# EasyEDA schematic Layout.json
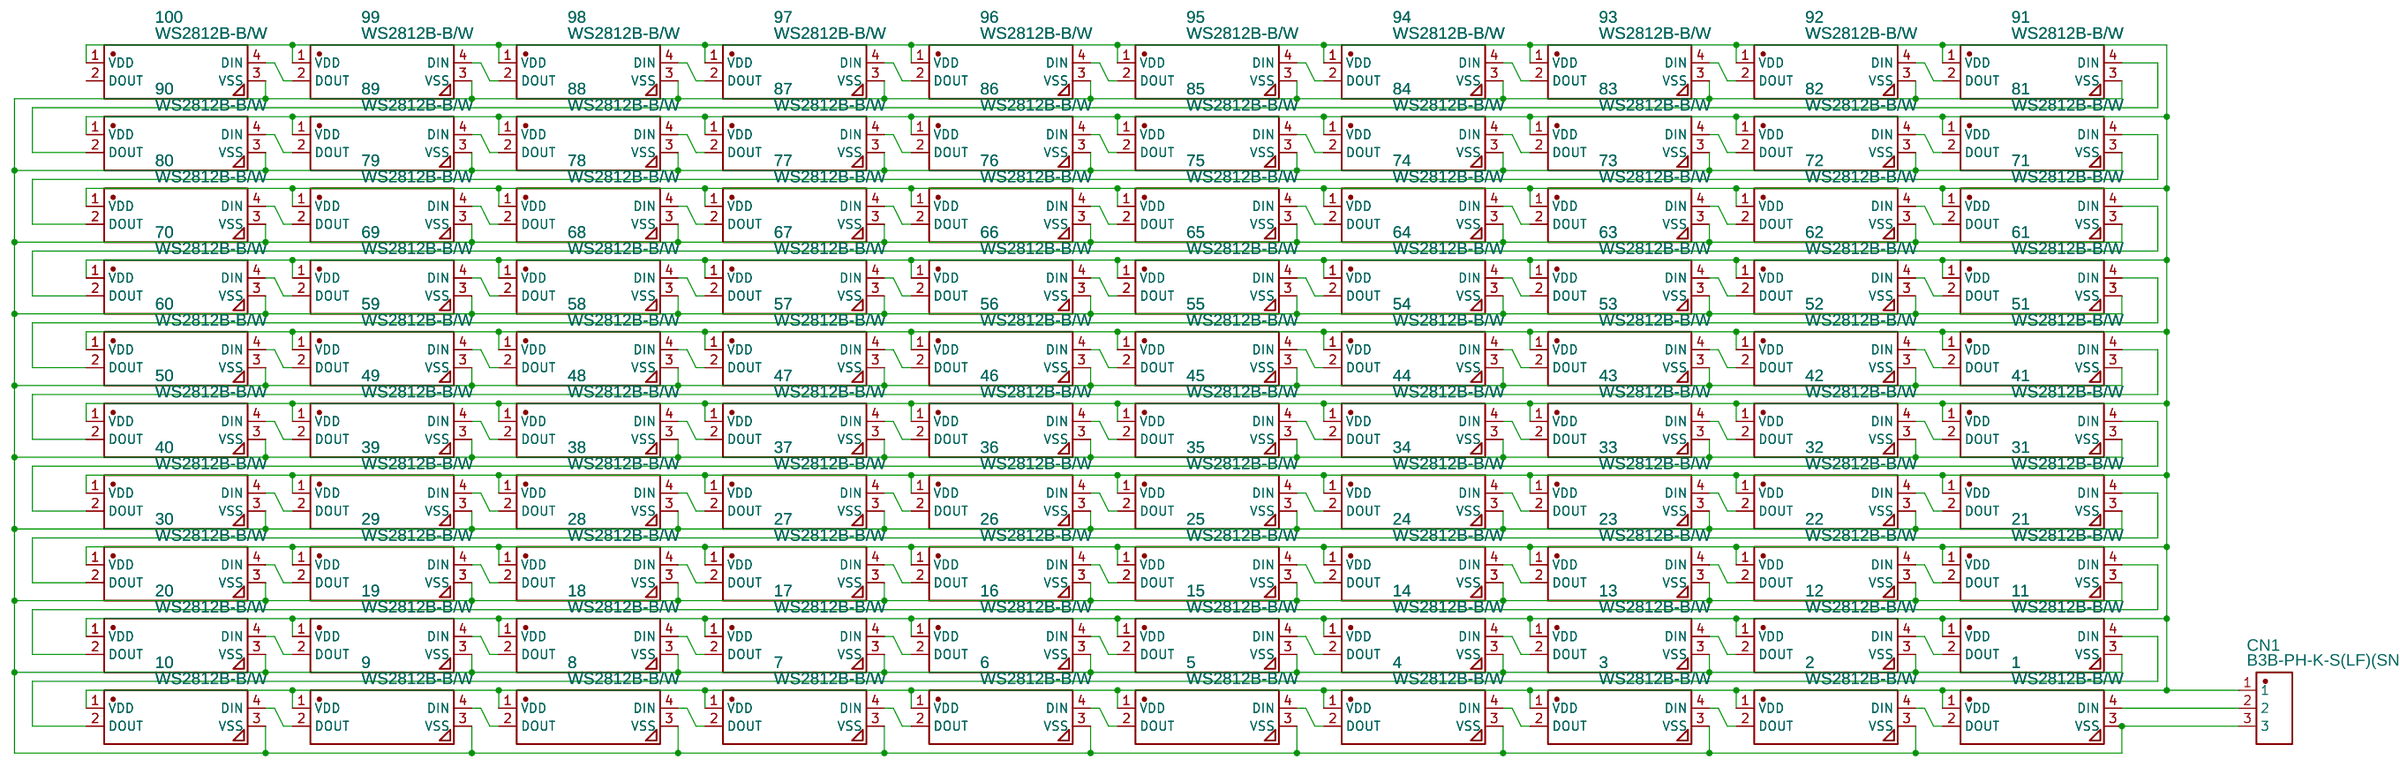
[diagram p0: schematic sheet]

## Parts
1  WS2812B-B/W  [LED-SMD_4P-L5.0-W5.0-TL_WS2812B-B]
2  WS2812B-B/W  [LED-SMD_4P-L5.0-W5.0-TL_WS2812B-B]
3  WS2812B-B/W  [LED-SMD_4P-L5.0-W5.0-TL_WS2812B-B]
4  WS2812B-B/W  [LED-SMD_4P-L5.0-W5.0-TL_WS2812B-B]
5  WS2812B-B/W  [LED-SMD_4P-L5.0-W5.0-TL_WS2812B-B]
6  WS2812B-B/W  [LED-SMD_4P-L5.0-W5.0-TL_WS2812B-B]
7  WS2812B-B/W  [LED-SMD_4P-L5.0-W5.0-TL_WS2812B-B]
8  WS2812B-B/W  [LED-SMD_4P-L5.0-W5.0-TL_WS2812B-B]
9  WS2812B-B/W  [LED-SMD_4P-L5.0-W5.0-TL_WS2812B-B]
10  WS2812B-B/W  [LED-SMD_4P-L5.0-W5.0-TL_WS2812B-B]
11  WS2812B-B/W  [LED-SMD_4P-L5.0-W5.0-TL_WS2812B-B]
12  WS2812B-B/W  [LED-SMD_4P-L5.0-W5.0-TL_WS2812B-B]
13  WS2812B-B/W  [LED-SMD_4P-L5.0-W5.0-TL_WS2812B-B]
14  WS2812B-B/W  [LED-SMD_4P-L5.0-W5.0-TL_WS2812B-B]
15  WS2812B-B/W  [LED-SMD_4P-L5.0-W5.0-TL_WS2812B-B]
16  WS2812B-B/W  [LED-SMD_4P-L5.0-W5.0-TL_WS2812B-B]
17  WS2812B-B/W  [LED-SMD_4P-L5.0-W5.0-TL_WS2812B-B]
18  WS2812B-B/W  [LED-SMD_4P-L5.0-W5.0-TL_WS2812B-B]
19  WS2812B-B/W  [LED-SMD_4P-L5.0-W5.0-TL_WS2812B-B]
20  WS2812B-B/W  [LED-SMD_4P-L5.0-W5.0-TL_WS2812B-B]
21  WS2812B-B/W  [LED-SMD_4P-L5.0-W5.0-TL_WS2812B-B]
22  WS2812B-B/W  [LED-SMD_4P-L5.0-W5.0-TL_WS2812B-B]
23  WS2812B-B/W  [LED-SMD_4P-L5.0-W5.0-TL_WS2812B-B]
24  WS2812B-B/W  [LED-SMD_4P-L5.0-W5.0-TL_WS2812B-B]
25  WS2812B-B/W  [LED-SMD_4P-L5.0-W5.0-TL_WS2812B-B]
26  WS2812B-B/W  [LED-SMD_4P-L5.0-W5.0-TL_WS2812B-B]
27  WS2812B-B/W  [LED-SMD_4P-L5.0-W5.0-TL_WS2812B-B]
28  WS2812B-B/W  [LED-SMD_4P-L5.0-W5.0-TL_WS2812B-B]
29  WS2812B-B/W  [LED-SMD_4P-L5.0-W5.0-TL_WS2812B-B]
30  WS2812B-B/W  [LED-SMD_4P-L5.0-W5.0-TL_WS2812B-B]
31  WS2812B-B/W  [LED-SMD_4P-L5.0-W5.0-TL_WS2812B-B]
32  WS2812B-B/W  [LED-SMD_4P-L5.0-W5.0-TL_WS2812B-B]
33  WS2812B-B/W  [LED-SMD_4P-L5.0-W5.0-TL_WS2812B-B]
34  WS2812B-B/W  [LED-SMD_4P-L5.0-W5.0-TL_WS2812B-B]
35  WS2812B-B/W  [LED-SMD_4P-L5.0-W5.0-TL_WS2812B-B]
36  WS2812B-B/W  [LED-SMD_4P-L5.0-W5.0-TL_WS2812B-B]
37  WS2812B-B/W  [LED-SMD_4P-L5.0-W5.0-TL_WS2812B-B]
38  WS2812B-B/W  [LED-SMD_4P-L5.0-W5.0-TL_WS2812B-B]
39  WS2812B-B/W  [LED-SMD_4P-L5.0-W5.0-TL_WS2812B-B]
40  WS2812B-B/W  [LED-SMD_4P-L5.0-W5.0-TL_WS2812B-B]
41  WS2812B-B/W  [LED-SMD_4P-L5.0-W5.0-TL_WS2812B-B]
42  WS2812B-B/W  [LED-SMD_4P-L5.0-W5.0-TL_WS2812B-B]
43  WS2812B-B/W  [LED-SMD_4P-L5.0-W5.0-TL_WS2812B-B]
44  WS2812B-B/W  [LED-SMD_4P-L5.0-W5.0-TL_WS2812B-B]
45  WS2812B-B/W  [LED-SMD_4P-L5.0-W5.0-TL_WS2812B-B]
46  WS2812B-B/W  [LED-SMD_4P-L5.0-W5.0-TL_WS2812B-B]
47  WS2812B-B/W  [LED-SMD_4P-L5.0-W5.0-TL_WS2812B-B]
48  WS2812B-B/W  [LED-SMD_4P-L5.0-W5.0-TL_WS2812B-B]
49  WS2812B-B/W  [LED-SMD_4P-L5.0-W5.0-TL_WS2812B-B]
50  WS2812B-B/W  [LED-SMD_4P-L5.0-W5.0-TL_WS2812B-B]
51  WS2812B-B/W  [LED-SMD_4P-L5.0-W5.0-TL_WS2812B-B]
52  WS2812B-B/W  [LED-SMD_4P-L5.0-W5.0-TL_WS2812B-B]
53  WS2812B-B/W  [LED-SMD_4P-L5.0-W5.0-TL_WS2812B-B]
54  WS2812B-B/W  [LED-SMD_4P-L5.0-W5.0-TL_WS2812B-B]
55  WS2812B-B/W  [LED-SMD_4P-L5.0-W5.0-TL_WS2812B-B]
56  WS2812B-B/W  [LED-SMD_4P-L5.0-W5.0-TL_WS2812B-B]
57  WS2812B-B/W  [LED-SMD_4P-L5.0-W5.0-TL_WS2812B-B]
58  WS2812B-B/W  [LED-SMD_4P-L5.0-W5.0-TL_WS2812B-B]
59  WS2812B-B/W  [LED-SMD_4P-L5.0-W5.0-TL_WS2812B-B]
60  WS2812B-B/W  [LED-SMD_4P-L5.0-W5.0-TL_WS2812B-B]
61  WS2812B-B/W  [LED-SMD_4P-L5.0-W5.0-TL_WS2812B-B]
62  WS2812B-B/W  [LED-SMD_4P-L5.0-W5.0-TL_WS2812B-B]
63  WS2812B-B/W  [LED-SMD_4P-L5.0-W5.0-TL_WS2812B-B]
64  WS2812B-B/W  [LED-SMD_4P-L5.0-W5.0-TL_WS2812B-B]
65  WS2812B-B/W  [LED-SMD_4P-L5.0-W5.0-TL_WS2812B-B]
66  WS2812B-B/W  [LED-SMD_4P-L5.0-W5.0-TL_WS2812B-B]
67  WS2812B-B/W  [LED-SMD_4P-L5.0-W5.0-TL_WS2812B-B]
68  WS2812B-B/W  [LED-SMD_4P-L5.0-W5.0-TL_WS2812B-B]
69  WS2812B-B/W  [LED-SMD_4P-L5.0-W5.0-TL_WS2812B-B]
70  WS2812B-B/W  [LED-SMD_4P-L5.0-W5.0-TL_WS2812B-B]
71  WS2812B-B/W  [LED-SMD_4P-L5.0-W5.0-TL_WS2812B-B]
72  WS2812B-B/W  [LED-SMD_4P-L5.0-W5.0-TL_WS2812B-B]
73  WS2812B-B/W  [LED-SMD_4P-L5.0-W5.0-TL_WS2812B-B]
74  WS2812B-B/W  [LED-SMD_4P-L5.0-W5.0-TL_WS2812B-B]
75  WS2812B-B/W  [LED-SMD_4P-L5.0-W5.0-TL_WS2812B-B]
76  WS2812B-B/W  [LED-SMD_4P-L5.0-W5.0-TL_WS2812B-B]
77  WS2812B-B/W  [LED-SMD_4P-L5.0-W5.0-TL_WS2812B-B]
78  WS2812B-B/W  [LED-SMD_4P-L5.0-W5.0-TL_WS2812B-B]
79  WS2812B-B/W  [LED-SMD_4P-L5.0-W5.0-TL_WS2812B-B]
80  WS2812B-B/W  [LED-SMD_4P-L5.0-W5.0-TL_WS2812B-B]
81  WS2812B-B/W  [LED-SMD_4P-L5.0-W5.0-TL_WS2812B-B]
82  WS2812B-B/W  [LED-SMD_4P-L5.0-W5.0-TL_WS2812B-B]
83  WS2812B-B/W  [LED-SMD_4P-L5.0-W5.0-TL_WS2812B-B]
84  WS2812B-B/W  [LED-SMD_4P-L5.0-W5.0-TL_WS2812B-B]
85  WS2812B-B/W  [LED-SMD_4P-L5.0-W5.0-TL_WS2812B-B]
86  WS2812B-B/W  [LED-SMD_4P-L5.0-W5.0-TL_WS2812B-B]
87  WS2812B-B/W  [LED-SMD_4P-L5.0-W5.0-TL_WS2812B-B]
88  WS2812B-B/W  [LED-SMD_4P-L5.0-W5.0-TL_WS2812B-B]
89  WS2812B-B/W  [LED-SMD_4P-L5.0-W5.0-TL_WS2812B-B]
90  WS2812B-B/W  [LED-SMD_4P-L5.0-W5.0-TL_WS2812B-B]
91  WS2812B-B/W  [LED-SMD_4P-L5.0-W5.0-TL_WS2812B-B]
92  WS2812B-B/W  [LED-SMD_4P-L5.0-W5.0-TL_WS2812B-B]
93  WS2812B-B/W  [LED-SMD_4P-L5.0-W5.0-TL_WS2812B-B]
94  WS2812B-B/W  [LED-SMD_4P-L5.0-W5.0-TL_WS2812B-B]
95  WS2812B-B/W  [LED-SMD_4P-L5.0-W5.0-TL_WS2812B-B]
96  WS2812B-B/W  [LED-SMD_4P-L5.0-W5.0-TL_WS2812B-B]
97  WS2812B-B/W  [LED-SMD_4P-L5.0-W5.0-TL_WS2812B-B]
98  WS2812B-B/W  [LED-SMD_4P-L5.0-W5.0-TL_WS2812B-B]
99  WS2812B-B/W  [LED-SMD_4P-L5.0-W5.0-TL_WS2812B-B]
100  WS2812B-B/W  [LED-SMD_4P-L5.0-W5.0-TL_WS2812B-B]
CN1  B3B-PH-K-S(LF)(SN)  [CONN-TH_B3B-PH-K-S]

## Library data of the parts
1-100 = WS2812B-B/W: Contributor: LCSC; Supplier: LCSC; Supplier Part: C2761795; Manufacturer: worldsemi; Manufacturer Part: WS2812B-B/T; JLCPCB Part Class: Extended Part
CN1 = B3B-PH-K-S(LF)(SN): Contributor: LCSC; Supplier: LCSC; Manufacturer: JST; Supplier Part: C131339; JLCPCB Part Class: Extended Part

## Nets
Net-(1-1): 1.1(VDD) 2.1(VDD) 3.1(VDD) 4.1(VDD) 5.1(VDD) 6.1(VDD) 7.1(VDD) 8.1(VDD) 9.1(VDD) 10.1(VDD) 11.1(VDD) 12.1(VDD) 13.1(VDD) 14.1(VDD) 15.1(VDD) 16.1(VDD) 17.1(VDD) 18.1(VDD) 19.1(VDD) 20.1(VDD) 21.1(VDD) 22.1(VDD) 23.1(VDD) 24.1(VDD) 25.1(VDD) 26.1(VDD) 27.1(VDD) 28.1(VDD) 29.1(VDD) 30.1(VDD) 31.1(VDD) 32.1(VDD) 33.1(VDD) 34.1(VDD) 35.1(VDD) 36.1(VDD) 37.1(VDD) 38.1(VDD) 39.1(VDD) 40.1(VDD) 41.1(VDD) 42.1(VDD) 43.1(VDD) 44.1(VDD) 45.1(VDD) 46.1(VDD) 47.1(VDD) 48.1(VDD) 49.1(VDD) 50.1(VDD) 51.1(VDD) 52.1(VDD) 53.1(VDD) 54.1(VDD) 55.1(VDD) 56.1(VDD) 57.1(VDD) 58.1(VDD) 59.1(VDD) 60.1(VDD) 61.1(VDD) 62.1(VDD) 63.1(VDD) 64.1(VDD) 65.1(VDD) 66.1(VDD) 67.1(VDD) 68.1(VDD) 69.1(VDD) 70.1(VDD) 71.1(VDD) 72.1(VDD) 73.1(VDD) 74.1(VDD) 75.1(VDD) 76.1(VDD) 77.1(VDD) 78.1(VDD) 79.1(VDD) 80.1(VDD) 81.1(VDD) 82.1(VDD) 83.1(VDD) 84.1(VDD) 85.1(VDD) 86.1(VDD) 87.1(VDD) 88.1(VDD) 89.1(VDD) 90.1(VDD) 91.1(VDD) 92.1(VDD) 93.1(VDD) 94.1(VDD) 95.1(VDD) 96.1(VDD) 97.1(VDD) 98.1(VDD) 99.1(VDD) 100.1(VDD) CN1.1
Net-(1-2): 1.2(DOUT) 2.4(DIN)
Net-(1-3): 1.3(VSS) 2.3(VSS) 3.3(VSS) 4.3(VSS) 5.3(VSS) 6.3(VSS) 7.3(VSS) 8.3(VSS) 9.3(VSS) 10.3(VSS) 11.3(VSS) 12.3(VSS) 13.3(VSS) 14.3(VSS) 15.3(VSS) 16.3(VSS) 17.3(VSS) 18.3(VSS) 19.3(VSS) 20.3(VSS) 21.3(VSS) 22.3(VSS) 23.3(VSS) 24.3(VSS) 25.3(VSS) 26.3(VSS) 27.3(VSS) 28.3(VSS) 29.3(VSS) 30.3(VSS) 31.3(VSS) 32.3(VSS) 33.3(VSS) 34.3(VSS) 35.3(VSS) 36.3(VSS) 37.3(VSS) 38.3(VSS) 39.3(VSS) 40.3(VSS) 41.3(VSS) 42.3(VSS) 43.3(VSS) 44.3(VSS) 45.3(VSS) 46.3(VSS) 47.3(VSS) 48.3(VSS) 49.3(VSS) 50.3(VSS) 51.3(VSS) 52.3(VSS) 53.3(VSS) 54.3(VSS) 55.3(VSS) 56.3(VSS) 57.3(VSS) 58.3(VSS) 59.3(VSS) 60.3(VSS) 61.3(VSS) 62.3(VSS) 63.3(VSS) 64.3(VSS) 65.3(VSS) 66.3(VSS) 67.3(VSS) 68.3(VSS) 69.3(VSS) 70.3(VSS) 71.3(VSS) 72.3(VSS) 73.3(VSS) 74.3(VSS) 75.3(VSS) 76.3(VSS) 77.3(VSS) 78.3(VSS) 79.3(VSS) 80.3(VSS) 81.3(VSS) 82.3(VSS) 83.3(VSS) 84.3(VSS) 85.3(VSS) 86.3(VSS) 87.3(VSS) 88.3(VSS) 89.3(VSS) 90.3(VSS) 91.3(VSS) 92.3(VSS) 93.3(VSS) 94.3(VSS) 95.3(VSS) 96.3(VSS) 97.3(VSS) 98.3(VSS) 99.3(VSS) 100.3(VSS) CN1.3
Net-(1-4): 1.4(DIN) CN1.2
Net-(2-2): 2.2(DOUT) 3.4(DIN)
Net-(3-2): 3.2(DOUT) 4.4(DIN)
Net-(4-2): 4.2(DOUT) 5.4(DIN)
Net-(5-2): 5.2(DOUT) 6.4(DIN)
Net-(6-2): 6.2(DOUT) 7.4(DIN)
Net-(7-2): 7.2(DOUT) 8.4(DIN)
Net-(8-2): 8.2(DOUT) 9.4(DIN)
Net-(9-2): 9.2(DOUT) 10.4(DIN)
Net-(10-2): 10.2(DOUT) 11.4(DIN)
Net-(11-2): 11.2(DOUT) 12.4(DIN)
Net-(12-2): 12.2(DOUT) 13.4(DIN)
Net-(13-2): 13.2(DOUT) 14.4(DIN)
Net-(14-2): 14.2(DOUT) 15.4(DIN)
Net-(15-2): 15.2(DOUT) 16.4(DIN)
Net-(16-2): 16.2(DOUT) 17.4(DIN)
Net-(17-2): 17.2(DOUT) 18.4(DIN)
Net-(18-2): 18.2(DOUT) 19.4(DIN)
Net-(19-2): 19.2(DOUT) 20.4(DIN)
Net-(20-2): 20.2(DOUT) 21.4(DIN)
Net-(21-2): 21.2(DOUT) 22.4(DIN)
Net-(22-2): 22.2(DOUT) 23.4(DIN)
Net-(23-2): 23.2(DOUT) 24.4(DIN)
Net-(24-2): 24.2(DOUT) 25.4(DIN)
Net-(25-2): 25.2(DOUT) 26.4(DIN)
Net-(26-2): 26.2(DOUT) 27.4(DIN)
Net-(27-2): 27.2(DOUT) 28.4(DIN)
Net-(28-2): 28.2(DOUT) 29.4(DIN)
Net-(29-2): 29.2(DOUT) 30.4(DIN)
Net-(30-2): 30.2(DOUT) 31.4(DIN)
Net-(31-2): 31.2(DOUT) 32.4(DIN)
Net-(32-2): 32.2(DOUT) 33.4(DIN)
Net-(33-2): 33.2(DOUT) 34.4(DIN)
Net-(34-2): 34.2(DOUT) 35.4(DIN)
Net-(35-2): 35.2(DOUT) 36.4(DIN)
Net-(36-2): 36.2(DOUT) 37.4(DIN)
Net-(37-2): 37.2(DOUT) 38.4(DIN)
Net-(38-2): 38.2(DOUT) 39.4(DIN)
Net-(39-2): 39.2(DOUT) 40.4(DIN)
Net-(40-2): 40.2(DOUT) 41.4(DIN)
Net-(41-2): 41.2(DOUT) 42.4(DIN)
Net-(42-2): 42.2(DOUT) 43.4(DIN)
Net-(43-2): 43.2(DOUT) 44.4(DIN)
Net-(44-2): 44.2(DOUT) 45.4(DIN)
Net-(45-2): 45.2(DOUT) 46.4(DIN)
Net-(46-2): 46.2(DOUT) 47.4(DIN)
Net-(47-2): 47.2(DOUT) 48.4(DIN)
Net-(48-2): 48.2(DOUT) 49.4(DIN)
Net-(49-2): 49.2(DOUT) 50.4(DIN)
Net-(50-2): 50.2(DOUT) 51.4(DIN)
Net-(51-2): 51.2(DOUT) 52.4(DIN)
Net-(52-2): 52.2(DOUT) 53.4(DIN)
Net-(53-2): 53.2(DOUT) 54.4(DIN)
Net-(54-2): 54.2(DOUT) 55.4(DIN)
Net-(55-2): 55.2(DOUT) 56.4(DIN)
Net-(56-2): 56.2(DOUT) 57.4(DIN)
Net-(57-2): 57.2(DOUT) 58.4(DIN)
Net-(58-2): 58.2(DOUT) 59.4(DIN)
Net-(59-2): 59.2(DOUT) 60.4(DIN)
Net-(60-2): 60.2(DOUT) 61.4(DIN)
Net-(61-2): 61.2(DOUT) 62.4(DIN)
Net-(62-2): 62.2(DOUT) 63.4(DIN)
Net-(63-2): 63.2(DOUT) 64.4(DIN)
Net-(64-2): 64.2(DOUT) 65.4(DIN)
Net-(65-2): 65.2(DOUT) 66.4(DIN)
Net-(66-2): 66.2(DOUT) 67.4(DIN)
Net-(67-2): 67.2(DOUT) 68.4(DIN)
Net-(68-2): 68.2(DOUT) 69.4(DIN)
Net-(69-2): 69.2(DOUT) 70.4(DIN)
Net-(70-2): 70.2(DOUT) 71.4(DIN)
Net-(71-2): 71.2(DOUT) 72.4(DIN)
Net-(72-2): 72.2(DOUT) 73.4(DIN)
Net-(73-2): 73.2(DOUT) 74.4(DIN)
Net-(74-2): 74.2(DOUT) 75.4(DIN)
Net-(75-2): 75.2(DOUT) 76.4(DIN)
Net-(76-2): 76.2(DOUT) 77.4(DIN)
Net-(77-2): 77.2(DOUT) 78.4(DIN)
Net-(78-2): 78.2(DOUT) 79.4(DIN)
Net-(79-2): 79.2(DOUT) 80.4(DIN)
Net-(80-2): 80.2(DOUT) 81.4(DIN)
Net-(81-2): 81.2(DOUT) 82.4(DIN)
Net-(82-2): 82.2(DOUT) 83.4(DIN)
Net-(83-2): 83.2(DOUT) 84.4(DIN)
Net-(84-2): 84.2(DOUT) 85.4(DIN)
Net-(85-2): 85.2(DOUT) 86.4(DIN)
Net-(86-2): 86.2(DOUT) 87.4(DIN)
Net-(87-2): 87.2(DOUT) 88.4(DIN)
Net-(88-2): 88.2(DOUT) 89.4(DIN)
Net-(89-2): 89.2(DOUT) 90.4(DIN)
Net-(90-2): 90.2(DOUT) 91.4(DIN)
Net-(91-2): 91.2(DOUT) 92.4(DIN)
Net-(92-2): 92.2(DOUT) 93.4(DIN)
Net-(93-2): 93.2(DOUT) 94.4(DIN)
Net-(94-2): 94.2(DOUT) 95.4(DIN)
Net-(95-2): 95.2(DOUT) 96.4(DIN)
Net-(96-2): 96.2(DOUT) 97.4(DIN)
Net-(97-2): 97.2(DOUT) 98.4(DIN)
Net-(98-2): 98.2(DOUT) 99.4(DIN)
Net-(99-2): 99.2(DOUT) 100.4(DIN)

Not connected (* = marked no-connect by the designer): 100 2(DOUT)
